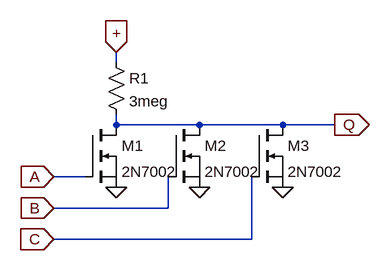
[diagram p0: schematic NOR3.asc]
NOR3.asc, the LTspice schematic file:
Version 4
SHEET 1 880 680
WIRE 272 144 272 128
WIRE 272 240 272 224
WIRE 400 240 272 240
WIRE 528 240 400 240
WIRE 608 240 528 240
WIRE 224 320 176 320
WIRE 352 368 352 320
WIRE 352 368 176 368
WIRE 480 416 480 320
WIRE 480 416 176 416
FLAG 272 336 0
FLAG 176 320 A
IOPIN 176 320 In
FLAG 608 240 Q
IOPIN 608 240 Out
FLAG 272 128 +
IOPIN 272 128 In
FLAG 400 336 0
FLAG 528 336 0
FLAG 176 368 B
IOPIN 176 368 In
FLAG 176 416 C
IOPIN 176 416 In
SYMBOL nmos 224 240 R0
SYMATTR InstName M1
SYMATTR Value 2N7002
SYMBOL res 256 128 R0
SYMATTR InstName R1
SYMATTR Value 3meg
SYMBOL nmos 352 240 R0
SYMATTR InstName M2
SYMATTR Value 2N7002
SYMBOL nmos 480 240 R0
SYMATTR InstName M3
SYMATTR Value 2N7002

The netlist it stands for:
* NOR3.asc
M1 Q A 0 0 2N7002
R1 + Q 3meg
M2 Q B 0 0 2N7002
M3 Q C 0 0 2N7002
.model NMOS NMOS
.model PMOS PMOS
.lib standard.mos
.backanno
.end